# Altium schematic sheet EthIO_02D_MCU_PE_PF.SchDoc
size A4; SheetNumber: 5; SheetTotal: 5
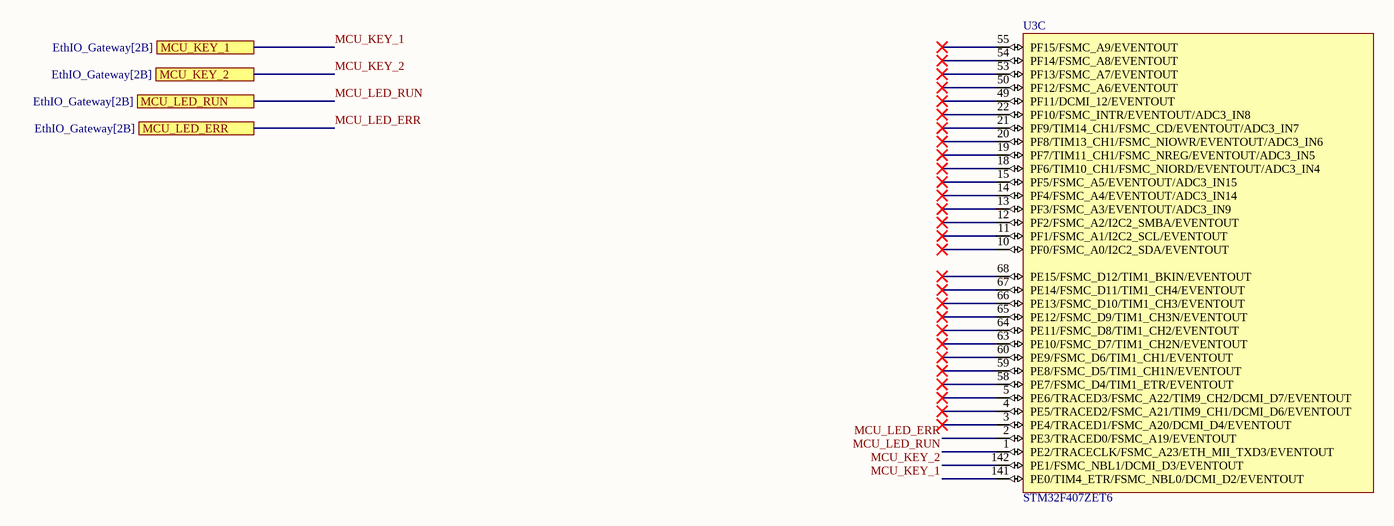
[diagram p0: EthIO_02D_MCU_PE_PF.SchDoc]

## Parts
U3  STM32F407ZET6  [TQFP144_V]  (part C of 5)

## Ports
MCU_KEY_1 (see EthIO_Gateway[2B]), MCU_KEY_2 (see EthIO_Gateway[2B]), MCU_LED_ERR (see EthIO_Gateway[2B]), MCU_LED_RUN (see EthIO_Gateway[2B])

## Nets
MCU_KEY_1: U3.141(PE0/TIM4_ETR/FSMC_NBL0/DCMI_D2/EVENTOUT) ; port MCU_KEY_1
MCU_KEY_2: U3.142(PE1/FSMC_NBL1/DCMI_D3/EVENTOUT) ; port MCU_KEY_2
MCU_LED_ERR: U3.2(PE3/TRACED0/FSMC_A19/EVENTOUT) ; port MCU_LED_ERR
MCU_LED_RUN: U3.1(PE2/TRACECLK/FSMC_A23/ETH_MII_TXD3/EVENTOUT) ; port MCU_LED_RUN

Not connected (* = marked no-connect by the designer): U3 3(PE4/TRACED1/FSMC_A20/DCMI_D4/EVENTOUT)* 4(PE5/TRACED2/FSMC_A21/TIM9_CH1/DCMI_D6/EVENTOUT)* 5(PE6/TRACED3/FSMC_A22/TIM9_CH2/DCMI_D7/EVENTOUT)* 10(PF0/FSMC_A0/I2C2_SDA/EVENTOUT)* 11(PF1/FSMC_A1/I2C2_SCL/EVENTOUT)* 12(PF2/FSMC_A2/I2C2_SMBA/EVENTOUT)* 13(PF3/FSMC_A3/EVENTOUT/ADC3_IN9)* 14(PF4/FSMC_A4/EVENTOUT/ADC3_IN14)* 15(PF5/FSMC_A5/EVENTOUT/ADC3_IN15)* 18(PF6/TIM10_CH1/FSMC_NIORD/EVENTOUT/ADC3_IN4)* 19(PF7/TIM11_CH1/FSMC_NREG/EVENTOUT/ADC3_IN5)* 20(PF8/TIM13_CH1/FSMC_NIOWR/EVENTOUT/ADC3_IN6)* 21(PF9/TIM14_CH1/FSMC_CD/EVENTOUT/ADC3_IN7)* 22(PF10/FSMC_INTR/EVENTOUT/ADC3_IN8)* 49(PF11/DCMI_12/EVENTOUT)* 50(PF12/FSMC_A6/EVENTOUT)* 53(PF13/FSMC_A7/EVENTOUT)* 54(PF14/FSMC_A8/EVENTOUT)* 55(PF15/FSMC_A9/EVENTOUT)* 58(PE7/FSMC_D4/TIM1_ETR/EVENTOUT)* 59(PE8/FSMC_D5/TIM1_CH1N/EVENTOUT)* 60(PE9/FSMC_D6/TIM1_CH1/EVENTOUT)* 63(PE10/FSMC_D7/TIM1_CH2N/EVENTOUT)* 64(PE11/FSMC_D8/TIM1_CH2/EVENTOUT)* 65(PE12/FSMC_D9/TIM1_CH3N/EVENTOUT)* 66(PE13/FSMC_D10/TIM1_CH3/EVENTOUT)* 67(PE14/FSMC_D11/TIM1_CH4/EVENTOUT)* 68(PE15/FSMC_D12/TIM1_BKIN/EVENTOUT)*

## Library data of the parts
U3 = STM32F407ZET6: ARM Cortex-M4 32b MCU+FPU, 210DMIP, 512 kB Flash, 192+4 kB RAM, Camera, 114 I/Os, 144-pin LQFP, -40 to +85癈, Tray; Internal RAM: 192kB; Operating Frequency (Processor Speed): 168MHz; A/D Converter: 24x12-bit; D/A Converter: 2x12-bit; 16-bit Timers (IC/OC/PWM): 12x16-bit(24/24/30); 32-bit Timer (IC/OC/PWM): 2x32-bit (8/8/8); Other Timer Functions: 2xWDG, RTC, 24-bit down counter; Serial Interface: 3xSPI/2xI2S/2xI2C/3xUSART(IrDa, ISO7816)/3xUART/2xUSB OTG FS/HS, 2xCAN/Ethernet MAC10/100, SDIO; 联系卖家，免费查找封装: 唯一出售店铺网址https://shop463601444.taobao.com; DatasheetVersion: rev2, Jan-2012; PackageVersion: 2012; PackageReference: TQFP144; PackageDescription: 144-Pin Low Profile Quad Flat Package, 20x20 mm Body, 0.5 mm Pitch; ComponentLink1Description: Manufacturer URL; ComponentLink1URL: http://www.st.com/; ComponentLink2Description: STM32F405/7 Datasheet; ComponentLink2URL: http://www.st.com/internet/com/TECHNICAL_RESOURCES/TECHNICAL_LITERATURE/DATASHEET/DM00037051.pdf; ComponentLink3Description: STM32F4 Web Page; ComponentLink3URL: http://www.st.com/internet/mcu/subclass/1521.jsp